# Altium project desf.PrjPcb
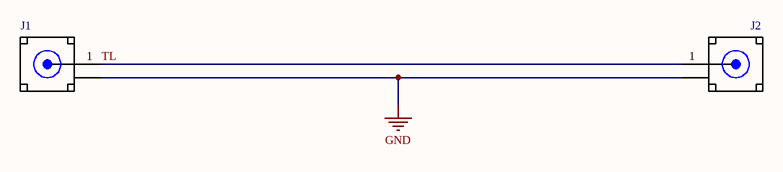
[diagram p0: tl.SchDoc]
1 sheet, 2 parts. Net scope: global (net labels, ports and power ports of the same name join across sheets).
Board file: tl.PcbDoc

## Sheet tl.SchDoc
size B

### Parts
J1  SMA-J-P-H-ST-EM1  [SAMTEC SMA-J-P-H-ST-EM1]  (value not drawn)
J2  SMA-J-P-H-ST-EM1  [SAMTEC SMA-J-P-H-ST-EM1]  (value not drawn)

### Nets
GND: J1.2(GND) J2.2(GND)
TL: J1.1(SIGNAL) J2.1(SIGNAL)

### Library data of the parts
J1 J2 = SMA-J-P-H-ST-EM1: CONN SMA JACK STR 50OHM EDGE MNT; Manufacturer: Samtec Inc.; Frequency - Max: 20GHz; Number of Ports: 1; Body Material: Brass; Body Finish: Gold; Dialetric Material: Polytetrafluoroethylene (PTFE); Center Contact Material: Beryllium Copper; Voltage Rating: 335V; Part Number: SMA-J-P-H-ST-EM1; ComponentLink1Description: Datasheet; ComponentLink1URL: http://suddendocs.samtec.com/catalog_english/sma.pdf; ComponentLink2Description: Drawing; ComponentLink2URL: http://suddendocs.samtec.com/prints/sma-j-p-x-st-em1-mkt.pdf; ComponentLink3Description: Digikey Link; ComponentLink3URL: https://www.digikey.com/products/en?keywords=SMA-J-P-H-ST-EM1; Device Package: Tray; Features: -; LastUpdated: 3/11/2020 6:05:05 AM; Lifecycle Status: Active; Minimum Order: 1; Operating Temperature: -65°C ~ 125°C; Packaging: Tray; Part Status: Active; Price: 4.33; Series: -; Supplier 1: DigiKey; Supplier Part Number 1: SAM8857-ND; Mounting Type: Board Edge, End Launch; Mounting Feature: -; Cable Group: -; Fastening Type: Threaded; Housing Color: Gold; Center Contact Plating: Gold; Mating Cycles: -; Insertion Loss: -; Connector Style: SMA